# EAGLE design DiveComputer_TFT18 (EAGLE 7.5.0)
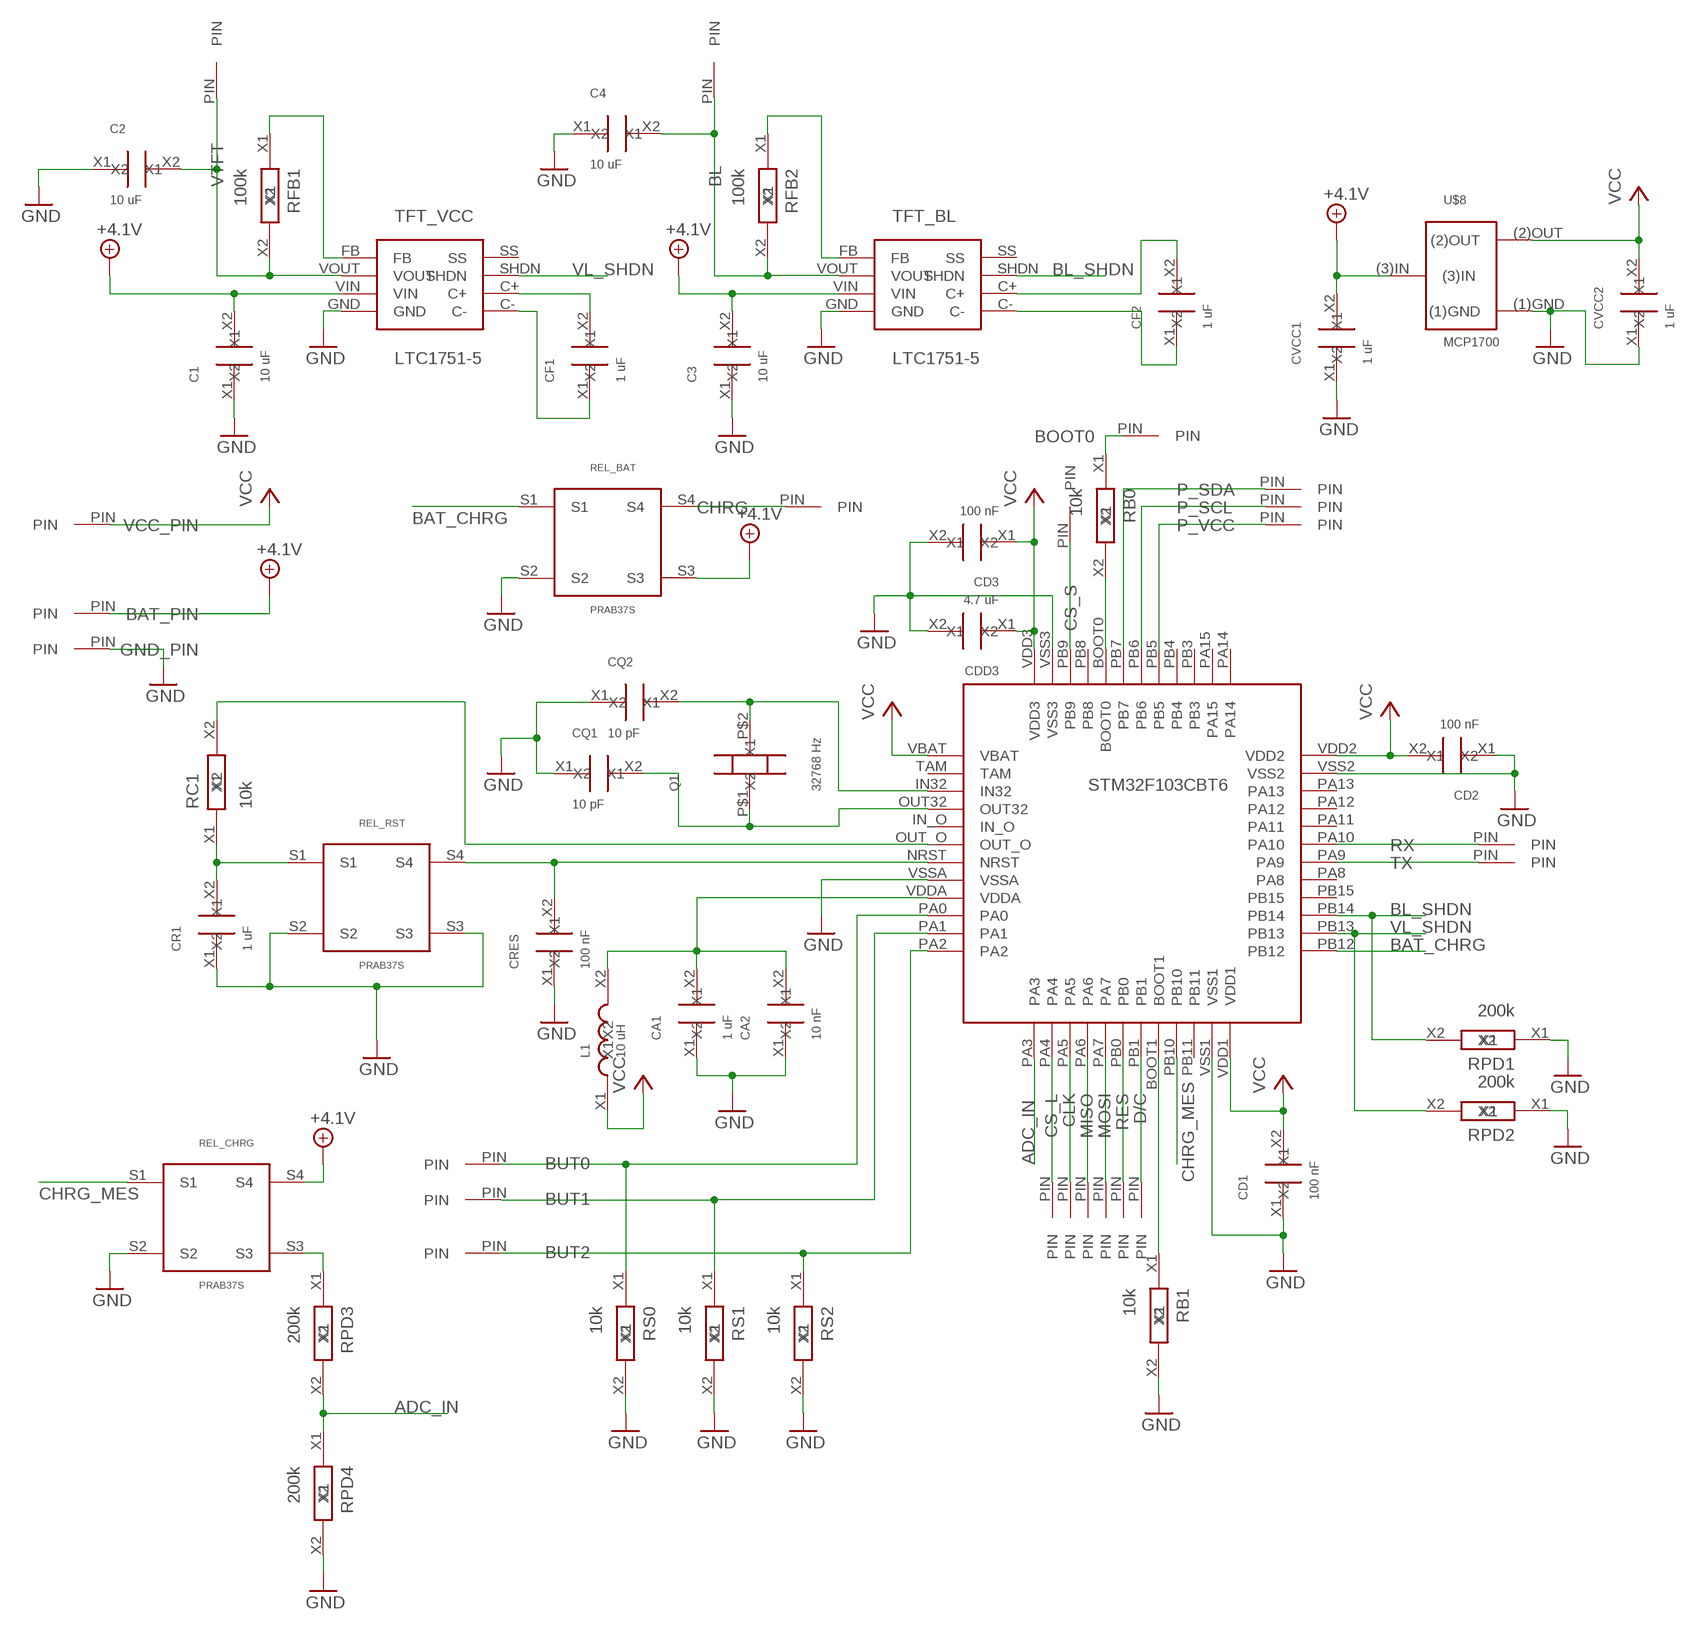
[diagram p0: schematic, sheet 1]

## Parts
BAT_PIN  PIN_06  [PIN_06]
BL  PIN_06  [PIN_06]
BOOT0  PIN_06  [PIN_06]
BUT0  PIN_06  [PIN_06]
BUT1  PIN_06  [PIN_06]
BUT2  PIN_06  [PIN_06]
C1  10 uF  C_SMD_2.1X1.25  [SMD_2.1X1.25]
C2  10 uF  C_SMD_2.1X1.25  [SMD_2.1X1.25]
C3  10 uF  C_SMD_2.1X1.25  [SMD_2.1X1.25]
C4  10 uF  C_SMD_2.1X1.25  [SMD_2.1X1.25]
CA1  1 uF  C_SMD_2.1X1.25  [SMD_2.1X1.25]
CA2  10 nF  C_SMD_2.1X1.25  [SMD_2.1X1.25]
CD1  100 nF  C_SMD_2.1X1.25  [SMD_2.1X1.25]
CD2  100 nF  C_SMD_2.1X1.25  [SMD_2.1X1.25]
CD3  100 nF  C_SMD_2.1X1.25  [SMD_2.1X1.25]
CDD3  4.7 uF  C_SMD_2.1X1.25  [SMD_2.1X1.25]
CF1  1 uF  C_SMD_2.1X1.25  [SMD_2.1X1.25]
CF2  1 uF  C_SMD_2.1X1.25  [SMD_2.1X1.25]
CHRG  PIN_06  [PIN_06]
CLK  PIN_06  [PIN_06]
CQ1  10 pF  C_SMD_2.1X1.25  [SMD_2.1X1.25]
CQ2  10 pF  C_SMD_2.1X1.25  [SMD_2.1X1.25]
CR1  1 uF  C_SMD_2.1X1.25  [SMD_2.1X1.25]
CRES  100 nF  C_SMD_2.1X1.25  [SMD_2.1X1.25]
CS_L  PIN_06  [PIN_06]
CS_S  PIN_06  [PIN_06]
CVCC1  1 uF  C_SMD_2.1X1.25  [SMD_2.1X1.25]
CVCC2  1 uF  C_SMD_2.1X1.25  [SMD_2.1X1.25]
D/C  PIN_06  [PIN_06]
GND_PIN  PIN_06  [PIN_06]
L1  10 uH  L_SMD_2.1X1.25  [SMD_2.1X1.25]
MISO  PIN_06  [PIN_06]
MOSI  PIN_06  [PIN_06]
P_SCL  PIN_06  [PIN_06]
P_SDA  PIN_06  [PIN_06]
P_VCC  PIN_06  [PIN_06]
Q1  32768 Hz  QUARTZ_CYL  [QUARTZ_CYL]
RB0  10k  R_SMD_2.1X1.25  [SMD_2.1X1.25]
RB1  10k  R_SMD_2.1X1.25  [SMD_2.1X1.25]
RC1  10k  R_SMD_2.1X1.25  [SMD_2.1X1.25]
REL_BAT  PRAB37S  [PRAB37S]
REL_CHRG  PRAB37S  [PRAB37S]
REL_RST  PRAB37S  [PRAB37S]
RES  PIN_06  [PIN_06]
RFB1  100k  R_SMD_2.1X1.25  [SMD_2.1X1.25]
RFB2  100k  R_SMD_2.1X1.25  [SMD_2.1X1.25]
RPD1  200k  R_SMD_2.1X1.25  [SMD_2.1X1.25]
RPD2  200k  R_SMD_2.1X1.25  [SMD_2.1X1.25]
RPD3  200k  R_SMD_2.1X1.25  [SMD_2.1X1.25]
RPD4  200k  R_SMD_2.1X1.25  [SMD_2.1X1.25]
RS0  10k  R_SMD_2.1X1.25  [SMD_2.1X1.25]
RS1  10k  R_SMD_2.1X1.25  [SMD_2.1X1.25]
RS2  10k  R_SMD_2.1X1.25  [SMD_2.1X1.25]
RX  PIN_06  [PIN_06]
STM32F103CBT6  STM32F103CBT6  [STM32F103CBT6]
TFT_BL  LTC1751-5  [LTC1751-5]
TFT_VCC  LTC1751-5  [LTC1751-5]
TX  PIN_06  [PIN_06]
U$8  MCP1700  [MCP1700]
VCC_PIN  PIN_06  [PIN_06]
VTFT  PIN_06  [PIN_06]

## Nets
+4.1V: BAT_PIN.PIN C1.X2 C3.X2 CVCC1.X2 REL_BAT.S3 REL_CHRG.S4 TFT_BL.VIN TFT_VCC.VIN U$8.(3)IN
ADC_IN: RPD3.X2 RPD4.X1 STM32F103CBT6.PA3
BAT_CHRG: REL_BAT.S1 STM32F103CBT6.PB12
BL_SHDN: RPD1.X2 STM32F103CBT6.PB14 TFT_BL.SHDN
CHRG_MES: REL_CHRG.S1 STM32F103CBT6.PB10
GND: C1.X1 C2.X1 C3.X1 C4.X1 CA1.X1 CA2.X1 CD1.X1 CD2.X1 CD3.X2 CDD3.X2 CQ1.X1 CQ2.X1 CR1.X1 CRES.X1 CVCC1.X1 CVCC2.X1 GND_PIN.PIN RB1.X2 REL_BAT.S2 REL_CHRG.S2 REL_RST.S2 REL_RST.S3 RPD1.X1 RPD2.X1 RPD4.X2 RS0.X2 RS1.X2 RS2.X2 STM32F103CBT6.VSS1 STM32F103CBT6.VSS2 STM32F103CBT6.VSS3 STM32F103CBT6.VSSA TFT_BL.GND TFT_VCC.GND U$8.(1)GND
N$1: CA1.X2 CA2.X2 L1.X2 STM32F103CBT6.VDDA
N$2: CRES.X2 REL_RST.S4 STM32F103CBT6.NRST
N$3: RB1.X1 STM32F103CBT6.BOOT1
N$4: CQ2.X2 Q1.P$2(X2) STM32F103CBT6.IN32
N$5: CQ1.X2 Q1.P$1(X1) STM32F103CBT6.OUT32
N$6: RB0.X2 STM32F103CBT6.BOOT0
N$7: BOOT0.PIN RB0.X1
N$8: BUT2.PIN RS2.X1 STM32F103CBT6.PA2
N$9: BUT1.PIN RS1.X1 STM32F103CBT6.PA1
N$10: BUT0.PIN RS0.X1 STM32F103CBT6.PA0
N$11: CS_L.PIN STM32F103CBT6.PA4
N$12: CLK.PIN STM32F103CBT6.PA5
N$13: MISO.PIN STM32F103CBT6.PA6
N$14: MOSI.PIN STM32F103CBT6.PA7
N$15: RES.PIN STM32F103CBT6.PB0
N$16: D/C.PIN STM32F103CBT6.PB1
N$17: CF1.X2 TFT_VCC.C+
N$18: CF1.X1 TFT_VCC.C-
N$19: CF2.X2 TFT_BL.C+
N$20: CF2.X1 TFT_BL.C-
N$21: BL.PIN C4.X2 RFB2.X2 TFT_BL.VOUT
N$22: RFB2.X1 TFT_BL.FB
N$23: C2.X2 RFB1.X2 TFT_VCC.VOUT VTFT.PIN
N$24: RFB1.X1 TFT_VCC.FB
N$25: CR1.X2 RC1.X1 REL_RST.S1
N$26: P_VCC.PIN STM32F103CBT6.PB5
N$27: P_SCL.PIN STM32F103CBT6.PB6
N$28: P_SDA.PIN STM32F103CBT6.PB7
N$29: CS_S.PIN STM32F103CBT6.PB9
N$30: STM32F103CBT6.PA9 TX.PIN
N$31: RX.PIN STM32F103CBT6.PA10
N$32: REL_CHRG.S3 RPD3.X1
N$33: RC1.X2 STM32F103CBT6.OUT_O
N$34: CHRG.PIN REL_BAT.S4
VCC: CD1.X2 CD2.X2 CD3.X1 CDD3.X1 CVCC2.X2 L1.X1 STM32F103CBT6.VBAT STM32F103CBT6.VDD1 STM32F103CBT6.VDD2 STM32F103CBT6.VDD3 U$8.(2)OUT VCC_PIN.PIN
VL_SHDN: RPD2.X2 STM32F103CBT6.PB13 TFT_VCC.SHDN
Unconnected: STM32F103CBT6.IN_O STM32F103CBT6.PA8 STM32F103CBT6.PA11 STM32F103CBT6.PA12 STM32F103CBT6.PA13 STM32F103CBT6.PA14 STM32F103CBT6.PA15 STM32F103CBT6.PB3 STM32F103CBT6.PB4 STM32F103CBT6.PB8 STM32F103CBT6.PB11 STM32F103CBT6.PB15 STM32F103CBT6.TAM TFT_BL.SS TFT_VCC.SS

## Library data of the parts
BAT_PIN BL BOOT0 BUT0 BUT1 BUT2 CHRG CLK CS_L CS_S D/C GND_PIN MISO MOSI P_SCL P_SDA P_VCC RES RX TX VCC_PIN VTFT = My_STM32:PIN_06
C1-C4 CA1 CA2 CD1-CD3 CDD3 CF1 CF2 CQ1 CQ2 CR1 CRES CVCC1 CVCC2 = MyPowerComponents:C_SMD_2.1X1.25
L1 = MyPowerComponents:L_SMD_2.1X1.25
Q1 = MySTM32F103RGT6:QUARTZ_CYL
RB0 RB1 RC1 RFB1 RFB2 RPD1-RPD4 RS0 RS1 RS2 = MyPowerComponents:R_SMD_2.1X1.25
REL_BAT REL_CHRG REL_RST = My_STM32:PRAB37S
STM32F103CBT6 = My_STM32:STM32F103CBT6
TFT_BL TFT_VCC = MyPowerComponents:LTC1751-5
U$8 = MyCMOSsensor:MCP1700

## Board
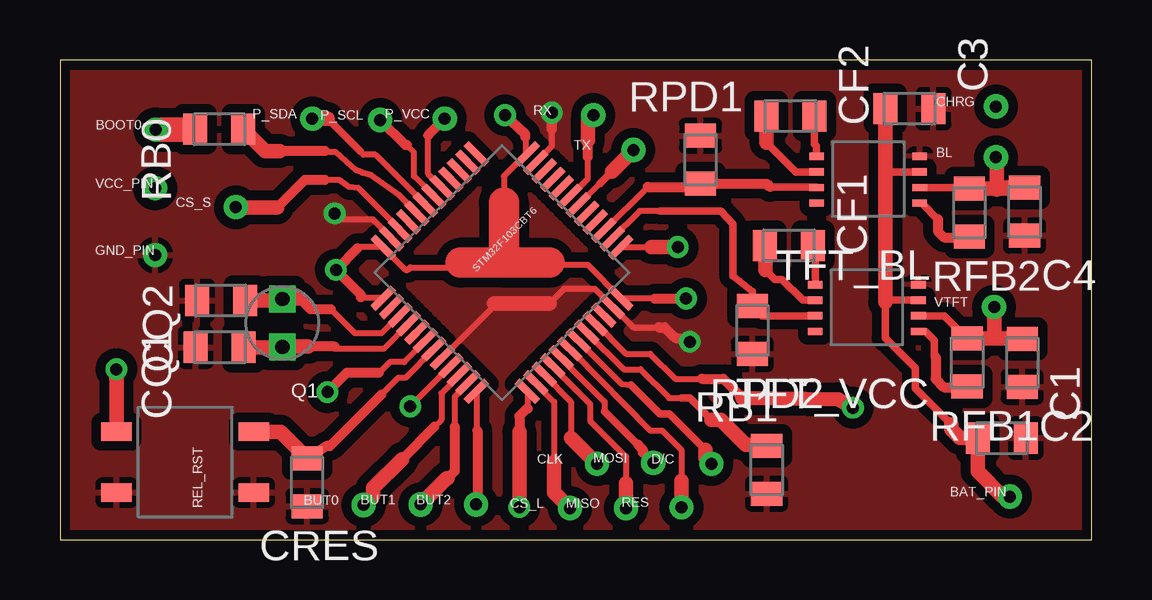
[diagram p1: board, top side]
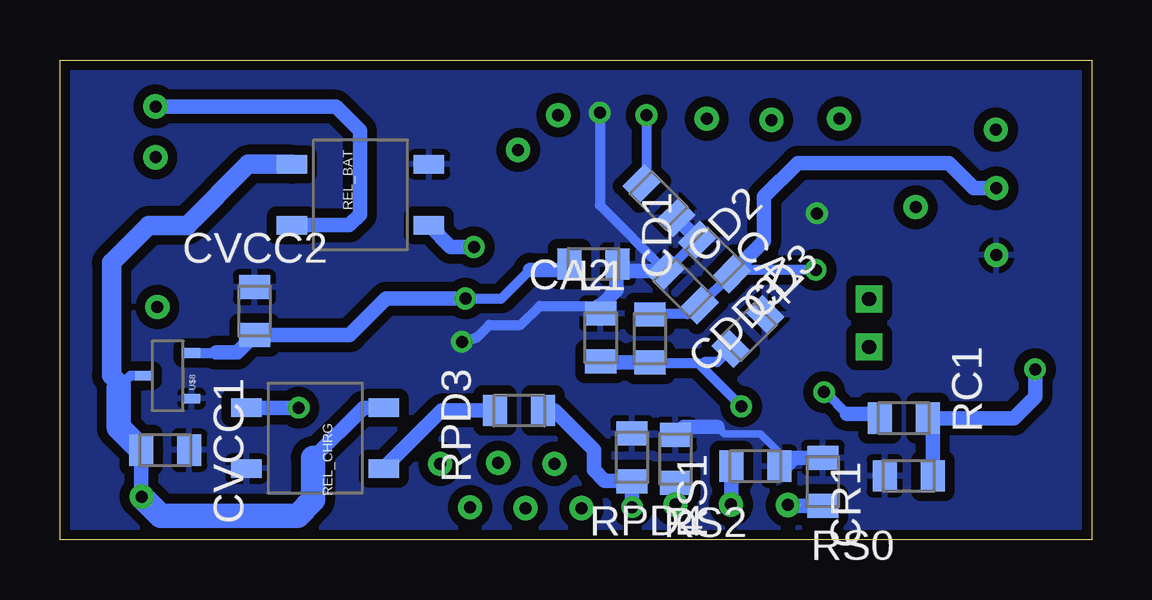
[diagram p2: board, bottom side, seen from below]

Size 43 x 20 mm. Coordinates in mm from the lower left corner, seen from the top.
Outline: 0,0 43,0 43,20 0,20 0,0
Copper layers (1*16): Top 0.035mm / dielectric 1.5mm / Bottom 0.035mm
Design rules "default *": minimum track width 10mil, minimum drill 24mil, track to track 8mil, track to pad 8mil, pad to pad 8mil, via to via 8mil, smd to smd 8mil, copper to edge 5mil, drill to drill 8mil, minimum pad ring 10mil, minimum via ring 8mil, stop-mask expansion 4mil, vias tented up to drill 0mil, thermal gap 10mil

### Footprints (pad centres in the part's own frame; a part is rotated, then mirrored left to right if it is on the bottom)
PIN_06 = drill 0.5: PIN 0,0
SMD_2.1X1.25 = smd 1.3 x 1: X1 0,1; X2 0,-1
QUARTZ_CYL = drill 0.6 square: P$1 0,1; P$2 0,-1
PRAB37S = smd 0.762 x 1.27: S1 -1.27,-2.54; S2 1.27,-2.54; S3 1.27,3.175; S4 -1.27,3.175
STM32F103CBT6 = smd 0.3 x 1.2: BOOT0 -0.75,4.25; BOOT1 0.75,-4.25; PA3 -2.75,-4.25; PA4 -2.25,-4.25; PA5 -1.75,-4.25; PA6 -1.25,-4.25; PA7 -0.75,-4.25; PA14 2.75,4.25; PA15 2.25,4.25; PB0 -0.25,-4.25; PB1 0.25,-4.25; PB3 1.75,4.25; PB4 1.25,4.25; PB5 0.75,4.25; PB6 0.25,4.25; PB7 -0.25,4.25; PB8 -1.25,4.25; PB9 -1.75,4.25; PB10 1.25,-4.25; PB11 1.75,-4.25; VDD1 2.75,-4.25; VDD3 -2.75,4.25; VSS1 2.25,-4.25; VSS3 -2.25,4.25 | smd 1.2 x 0.3: IN32 -4.25,1.75; IN_O -4.25,0.75; NRST -4.25,-0.25; OUT32 -4.25,1.25; OUT_O -4.25,0.25; PA0 -4.25,-1.75; PA1 -4.25,-2.25; PA2 -4.25,-2.75; PA8 4.25,-0.75; PA9 4.25,-0.25; PA10 4.25,0.25; PA11 4.25,0.75; PA12 4.25,1.25; PA13 4.25,1.75; PB12 4.25,-2.75; PB13 4.25,-2.25; PB14 4.25,-1.75; PB15 4.25,-1.25; TAM -4.25,2.25; VBAT -4.25,2.75; VDD2 4.25,2.75; VDDA -4.25,-1.25; VSS2 4.25,2.25; VSSA -4.25,-0.75
LTC1751-5 = smd 0.61 x 0.305: C+ 2.15,0; C- 2.15,-0.65; FB -2.15,1.3; GND -2.15,-0.65; SHDN 2.15,0.65; SS 2.15,1.3; VIN -2.15,0; VOUT -2.15,0.65
MCP1700 = smd 0.4 x 0.7: (1)GND -0.95,-2; (2)OUT 0.95,-2; (3)IN 0,0

### Placement (x,y rotation side)
BAT_PIN  39.6,1.79 0 top
BL  39.02,15.94 0 top
BOOT0  3.99,17.09 0 top
BUT0  12.66,1.44 0 top
BUT1  15.03,1.46 0 top
BUT2  17.35,1.46 0 top
C1  39.26,4.23 270 top
C2  40.11,7.37 180 top
C3  35.41,17.97 270 top
C4  40.21,13.67 180 top
CA1  14.33,8.67 315 bottom
CA2  20.46,8.42 0 bottom
CD1  20.76,11.49 270 bottom
CD2  18.04,14.14 225 bottom
CD3  15.72,11.79 225 bottom
CDD3  17.05,10.49 225 bottom
CF1  30.38,12.26 270 top
CF2  30.45,17.66 270 top
CHRG  39.02,18.06 0 top
CLK  22.39,3.16 0 top
CQ1  6.66,8.02 90 top
CQ2  6.71,9.97 90 top
CR1  7.62,2.66 90 bottom
CRES  10.3,2.39 180 top
CS_L  21.26,1.31 0 top
CS_S  7.33,13.86 0 top
CVCC1  38.61,3.73 270 bottom
CVCC2  34.89,9.53 0 bottom
D/C  27.15,3.16 0 top
GND_PIN  3.97,11.86 0 top
L1  18.41,8.38 0 bottom
MISO  23.59,1.31 0 top
MOSI  24.73,3.2 0 top
P_SCL  13.35,17.5 0 top
P_SDA  10.52,17.55 0 top
P_VCC  16.04,17.55 0 top
Q1  9.27,9.03 180 top
RB0  6.64,17.11 90 top
RB1  29.46,2.91 0 top
RC1  7.83,5.06 270 bottom
REL_BAT  30.16,14.38 90 bottom
REL_CHRG  32.68,4.23 270 bottom
REL_RST  4.9,3.23 270 top
RES  25.91,1.35 0 top
RFB1  37.81,7.38 180 top
RFB2  37.91,13.63 180 top
RPD1  26.7,15.84 0 top
RPD2  28.86,8.73 180 top
RPD3  23.86,5.38 90 bottom
RPD4  19.16,3.43 180 bottom
RS0  11.2,2.41 180 bottom
RS1  14.02,3.06 90 bottom
RS2  17.34,3.36 180 bottom
RX  22.23,17.7 0 top
STM32F103CBT6  18.42,11.13 45 top
TFT_BL  33.69,15.33 180 top
TFT_VCC  33.63,9.98 180 top
TX  23.9,16.25 0 top
U$8  39.51,6.83 90 bottom
VCC_PIN  3.97,14.65 0 top
VTFT  38.94,9.7 0 top

### Tracks (layer width: path | path; a pad name or v marks a point on that pad's centre or on a via)
+4.1V
  Top 0.305: TFT_VCC.VIN 35.76,10 34.35,10 34.4,9.95 34.4,9.9 34.4,8.4 35.65,7.15 35.65,6.3 37.15,4.8 | TFT_BL.VIN 34.43,15.33 34.41,15.35
  Top 0.61: BAT_PIN.PIN 39.31,1.79 38.25,2.85 C1.X2 38.24,4.25 37.5,4.25 37.15,4.6 37.15,4.8 | C3.X2 34.41,15.35 34.41,9.91 34.4,9.9
  Bottom 0.406: U$8.(3)IN 40.07,6.83 40.45,6.45 40.55,6.35
  Bottom 0.61: REL_CHRG.S4 30.35,5.5 32.45,3.4 | CVCC1.X2 BAT_PIN.PIN
  Bottom 0.813: REL_BAT.S3 35.15,15.65 37.7,13.1 39.3,13.1 40.85,11.55 40.85,6.85 40.45,6.45
  Bottom 1.016: 32.45,3.4 32.45,1.65 33.1,1 38.81,1 BAT_PIN.PIN | 40.55,6.35 40.55,4.67 CVCC1.X2
ADC_IN  (via drill 0.5)
  Top 0.254: STM32F103CBT6.PA3 19.48,5.47 19.5,5.45
  Top 0.406: 19.5,5.45 19.45,5.45 19.15,5.15 19.15,4.5
  Top 0.61: 19.15,4.5 v19.15,1.35
  Bottom 0.61: v19.15,1.35 RPD4.X1 19.18,2.45 20.3,2.45 20.75,2.9 20.75,3.75 22.38,5.38 RPD3.X2
BAT_CHRG  (via drill 0.5)
  Top 0.254: STM32F103CBT6.PB12 24.64,12.19 24.65,12.2
  Top 0.61: 24.65,12.2 v25.75,12.2
  Bottom 0.61: v25.75,12.2 26.71,12.2 REL_BAT.S1
BL_SHDN
  Top 0.254: STM32F103CBT6.PB14 22.7,12.9 24.5,14.7
  Top 0.305: 29.6,14.7 31.52,14.7 TFT_BL.SHDN
  Top 0.406: 24.5,14.7 26.56,14.7 RPD1.X2 29.46,14.84 29.6,14.7
CHRG_MES  (via drill 0.5)
  Top 0.254: STM32F103CBT6.PB10 22.34,9.01 23.6,7.75 24.6,7.75 25.65,6.7 26.75,6.7
  Top 0.406: 26.75,6.7 27.65,6.7 28.45,5.9
  Top 0.61: 28.45,5.9 32.45,5.85 v33.05,5.5
  Bottom 0.61: v33.05,5.5 REL_CHRG.S1
GND  (via drill 0.5)
  Top 0.254: 20.4,9.85 21,10.45 22.3,10.45 23.02,9.73 STM32F103CBT6.VSS1 23.03,9.72 23.9,8.85 24.95,8.85 | 18.1,9.85 18.1,9.75 STM32F103CBT6.VSSA | STM32F103CBT6.VSS2 19.88,15.73 19.88,15.78 20.5,16.4 20.5,17.1 | STM32F103CBT6.VSS3 13.82,12.58 13.05,13.35 11.7,13.35 v11.45,13.6
  Top 0.406: 20.5,17.1 v20.5,17.8 | 24.95,8.85 25.2,8.85 25.6,8.45 v26.25,8.25
  Top 0.61: 20.4,9.85 18.1,9.85
  Bottom 0.305: RS1.X2 13.02,3.62 13.8,4.4 15.3,4.4 15.6,4.7
  Bottom 0.406: v20.5,17.8 20.5,13.94 CDD3.X2 17.73,11.2 CD3.X2 16.12,12.8 | v26.25,8.25 25.6,8.45 25.1,8.95 23.8,8.95 23,9.75 20.55,9.75
  Bottom 0.61: CD3.X2 16.43,12.53 CD2.X1 | 20.55,9.75 20.45,9.75 19.8,10.4 19.8,11.45 CD1.X1 19.47,11.2 CDD3.X2 | RS1.X2 12.74,3.06 12.4,3.4 RS0.X2 | 15.6,4.7 17,4.7 RS2.X2
  pour Bottom (isolate 0.406): -0.05,20 43,20 43,0 0,-0.1
  pour Top (isolate 0.406): 0,20.05 43,20 43,0 0,-0.05
N$1  (via drill 0.5)
  Top 0.254: STM32F103CBT6.VDDA v14.6,5.55
  Bottom 0.406: v14.6,5.55 STM32F103CBT6.VDDA | STM32F103CBT6.VDDA 16.4,7.35 18.38,7.35 L1.X2 | CA1.X2 15.6,7.4 16.14,7.4 STM32F103CBT6.VDDA
  Bottom 0.61: L1.X2 20.42,7.38 CA2.X2
N$2
  Top 0.254: STM32F103CBT6.NRST 14.4,6.75 14.1,6.75 13.4,6.05
  Top 0.406: 13.4,6.05 11.25,3.9 11.11,3.9 CRES.X2
  Top 0.61: REL_RST.S4 9.19,4.5 CRES.X2
N$3
  Top 0.254: STM32F103CBT6.BOOT1 21.96,8.64 23.5,7.1 24.2,7.1 25.4,5.9 25.9,5.9
  Top 0.305: 25.9,5.9 26.25,5.9 27.15,5
  Top 0.61: 27.15,5 27.55,5 28.6,3.95 29.42,3.95 RB1.X1
N$4
  Top 0.254: STM32F103CBT6.IN32 14.16,9.36 13.4,8.6 12.3,8.6 11.3,9.6
  Top 0.406: 11.3,9.6 10.45,9.6 10,10.05
  Top 0.61: 10,10.05 9.29,10.05 Q1.P$2 9.21,9.97 CQ2.X2
N$5
  Top 0.254: STM32F103CBT6.OUT32 14.53,8.98 13.5,7.95 11.55,7.95 11.45,8.05
  Top 0.406: 11.45,8.05 10.35,8.05
  Top 0.61: 10.35,8.05 9.29,8.05 Q1.P$1 CQ1.X2
N$6
  Top 0.254: STM32F103CBT6.BOOT0 14.88,13.62 14.15,14.35 12.95,15.2 12.6,15.3 12.35,15.4 11.5,16.15 11.1,16.15 11.05,16.2
  Top 0.406: 11.05,16.2 9.15,16.2
  Top 0.61: 9.15,16.2 8.55,16.2 RB0.X2
N$7
  Top 1.016: BOOT0.PIN 5.62,17.09 RB0.X1
N$8
  Top 0.254: STM32F103CBT6.PA2 17.36,4.59 17.4,4.55
  Top 0.406: 17.4,4.55 17.4,1.51 BUT2.PIN
  Bottom 0.61: RS2.X1 BUT2.PIN
N$9
  Top 0.254: STM32F103CBT6.PA1 16.98,6.53 16.98,6.48 16.45,5.95 16.45,4.7
  Top 0.406: 16.45,4.7 16.45,2.85 16.15,2.55
  Top 0.61: 16.15,2.55 16.12,2.55 BUT1.PIN
  Bottom 0.61: RS1.X1 BUT1.PIN
N$10
  Top 0.254: STM32F103CBT6.PA0 16.65,6.85 15.9,6.1 15.9,5 15.6,4.7
  Top 0.406: 15.6,4.7 14.25,3.35
  Top 0.61: 14.25,3.35 13.05,2.15 13.05,1.83 BUT0.PIN
  Bottom 0.61: RS0.X1 12.63,1.41 BUT0.PIN
N$11
  Top 0.254: STM32F103CBT6.PA4 19.83,6.52 20.6,5.75 20.6,3.25
  Top 0.61: 20.6,3.25 20.6,1.97 CS_L.PIN
N$12
  Top 0.254: STM32F103CBT6.PA5 20.19,6.86 21.3,5.75 21.3,4.25
  Top 0.61: 21.3,4.25 CLK.PIN
N$13
  Top 0.254: STM32F103CBT6.PA6 20.54,7.21 22.1,5.65 22.1,4.95 23.6,3.45 23.6,2.35
  Top 0.61: 23.6,2.35 23.6,1.17 MISO.PIN
N$14
  Top 0.254: STM32F103CBT6.PA7 20.89,7.55 22.7,5.75 22.7,5.35
  Top 0.305: 22.7,5.35 24.1,3.95
  Top 0.406: 24.1,3.95 24.3,3.75 24.3,3.63 MOSI.PIN
N$15
  Top 0.254: STM32F103CBT6.PB0 21.45,7.75 24.6,4.55 25.1,4.55 25.9,3.75 25.9,2.45
  Top 0.61: 25.9,2.45 25.9,1.21 RES.PIN
N$16
  Top 0.254: STM32F103CBT6.PB1 23.4,6.5 23.8,6.45
  Top 0.305: 23.8,6.45 25,5.25 25.4,5.25 26.9,3.75
  Top 0.61: 26.9,3.75 26.9,3.41 D/C.PIN
N$17
  Top 0.305: TFT_VCC.C+ 30.97,9.98 30.1,10.85 29.8,10.85 29.4,11.25
  Top 0.61: 29.4,11.25 29.4,12.24 CF1.X2
N$18
  Top 0.305: TFT_VCC.C- 31.48,12.16 CF1.X1
N$19
  Top 0.305: TFT_BL.C+ 30.67,15.33 29.45,16.55
  Top 0.61: 29.45,16.55 CF2.X2
N$20
  Top 0.305: TFT_BL.C- 31.54,16.41 31.45,16.5 CF2.X1
N$21
  Top 0.305: TFT_BL.VOUT 37.86,14.68 RFB2.X2
  Top 0.61: RFB2.X2 40.17,14.63 C4.X2 39.12,14.67 39.05,14.6 39.05,15.51 BL.PIN
N$22
  Top 0.305: TFT_BL.FB 35.92,14.03 36.6,13.35
  Top 0.406: 36.6,13.35 36.6,12.85 36.85,12.6 37.88,12.6 RFB2.X1
N$23
  Top 0.305: TFT_VCC.VOUT 36.86,9.33 RFB1.X2
  Top 0.61: RFB1.X2 38.95,8.38 | 38.95,8.38 C2.X2 | VTFT.PIN 38.94,8.39 38.95,8.38
N$24
  Top 0.305: TFT_VCC.FB 36.07,8.68 36.45,8.3 36.45,7.65 36.5,7.6
  Top 0.406: 36.5,7.6 36.5,6.7 36.85,6.35 37.78,6.35 RFB1.X1
N$25  (via drill 0.5)
  Top 0.61: REL_RST.S1 2.36,6.69 2.35,6.7 v2.35,7.1
  Bottom 0.61: CR1.X2 6.62,4.85 RC1.X1 3.25,5.05 2.35,5.95 v2.35,7.1
N$26
  Top 0.254: STM32F103CBT6.PB5 15.93,14.67 15.35,15.25 15.35,16.85
  Top 0.406: 15.35,16.85 15.35,16.86 P_VCC.PIN
N$27
  Top 0.254: STM32F103CBT6.PB6 14.75,15.15 14.75,16.15 14.45,16.45
  Top 0.406: 14.45,16.45 14.4,16.45 P_SCL.PIN
N$28
  Top 0.254: STM32F103CBT6.PB7 13.15,16.05 12.65,16.05 12.5,16.2
  Top 0.305: 12.5,16.2 11.15,17.55
  Top 0.61: 11.15,17.55 P_SDA.PIN
N$29
  Top 0.254: STM32F103CBT6.PB9 14.18,12.92 12.45,14.65 12.05,14.7 11.65,15 11.05,15
  Top 0.406: 11.05,15 10.2,15 9.05,13.85
  Top 0.61: 9.05,13.85 CS_S.PIN
N$30
  Top 0.254: STM32F103CBT6.PA9 22.5,14.85
  Top 0.305: 22.5,14.85 23,15.35
  Top 0.61: 23,15.35 TX.PIN
N$31
  Top 0.254: STM32F103CBT6.PA10 21.26,14.31 22,15.05 22,15.95
  Top 0.406: 22,15.95 22,16.65
  Top 0.61: 22,16.65 22,17.47 RX.PIN
N$32
  Bottom 0.61: RPD3.X1 27.09,5.38 REL_CHRG.S3
N$33  (via drill 0.5)
  Top 0.254: STM32F103CBT6.OUT_O 15.24,8.29 14.35,7.4 13.75,7.4 13.3,6.95
  Top 0.406: 13.3,6.95 11.95,6.95 v11.15,6.15
  Bottom 0.406: v11.15,6.15 11.1,6.15 10.2,5.25
  Bottom 0.61: 10.2,5.25 9.02,5.25 RC1.X2
N$34
  Bottom 0.61: REL_BAT.S4 30.94,13.11 30.5,13.55 30.5,17.05 31.5,18.05 CHRG.PIN
VCC  (via drill 0.5)
  Top 0.254: STM32F103CBT6.VDD2 19.43,16.08 | 19.43,16.08 18.5,15.15 18.5,14.05 | 20.4,11.55 20.5,11.45 22,11.45 STM32F103CBT6.VDD1 24.78,10.07 24.8,10.05 | 16.7,11.55 16.5,11.35 14.6,11.35 14.5,11.25 14.4,11.25 STM32F103CBT6.VDD3 12.44,12.19 12.4,12.15 | STM32F103CBT6.VBAT 12.58,10.07 12.55,10.1 | 19.43,16.08 19.43,16.87 19.4,16.8
  Top 0.406: 12.4,12.15 v11.5,11.25 12.55,10.2 12.55,10.1 | 19.4,16.8 19.4,16.9 v18.55,17.7 | 24.8,10.05 v26.1,10.05
  Top 1.27: 18.5,14.05 18.5,11.55 | 18.5,11.55 20.4,11.55 | 18.5,11.55 16.7,11.55
  Bottom 0.406: v11.5,11.25 14.85,11.25 CD3.X1 16.31,9.78 CDD3.X1 16.47,9.78 16.85,9.4 18.39,9.4 L1.X1 | v18.55,17.7 18.55,15.04 CD2.X2 | v26.1,10.05 24.6,10.05 23.4,11.25 | U$8.(2)OUT 36.52,7.78 36.5,7.8
  Bottom 0.61: 23.4,11.25 22,11.25 CD1.X2 | 36.5,7.8 35.62,7.8 CVCC2.X2 30.92,8.53 29.4,10.05 v26.1,10.05 | VCC_PIN.PIN 4.9,14.65 5.95,15.7 12.25,15.7 13.65,14.3 13.65,12.45 CD3.X1
VL_SHDN
  Top 0.254: 25,13.7 24.17,13.7 STM32F103CBT6.PB13
  Top 0.305: TFT_VCC.SHDN 29.26,9.33 RPD2.X2 28.86,10.34 28.05,11 28.05,13.15 27.55,13.7 25,13.7